# Altium schematic sheet PC104_headers_and_storage.SchDoc
size A3; SheetNumber: 2; SheetTotal: 2
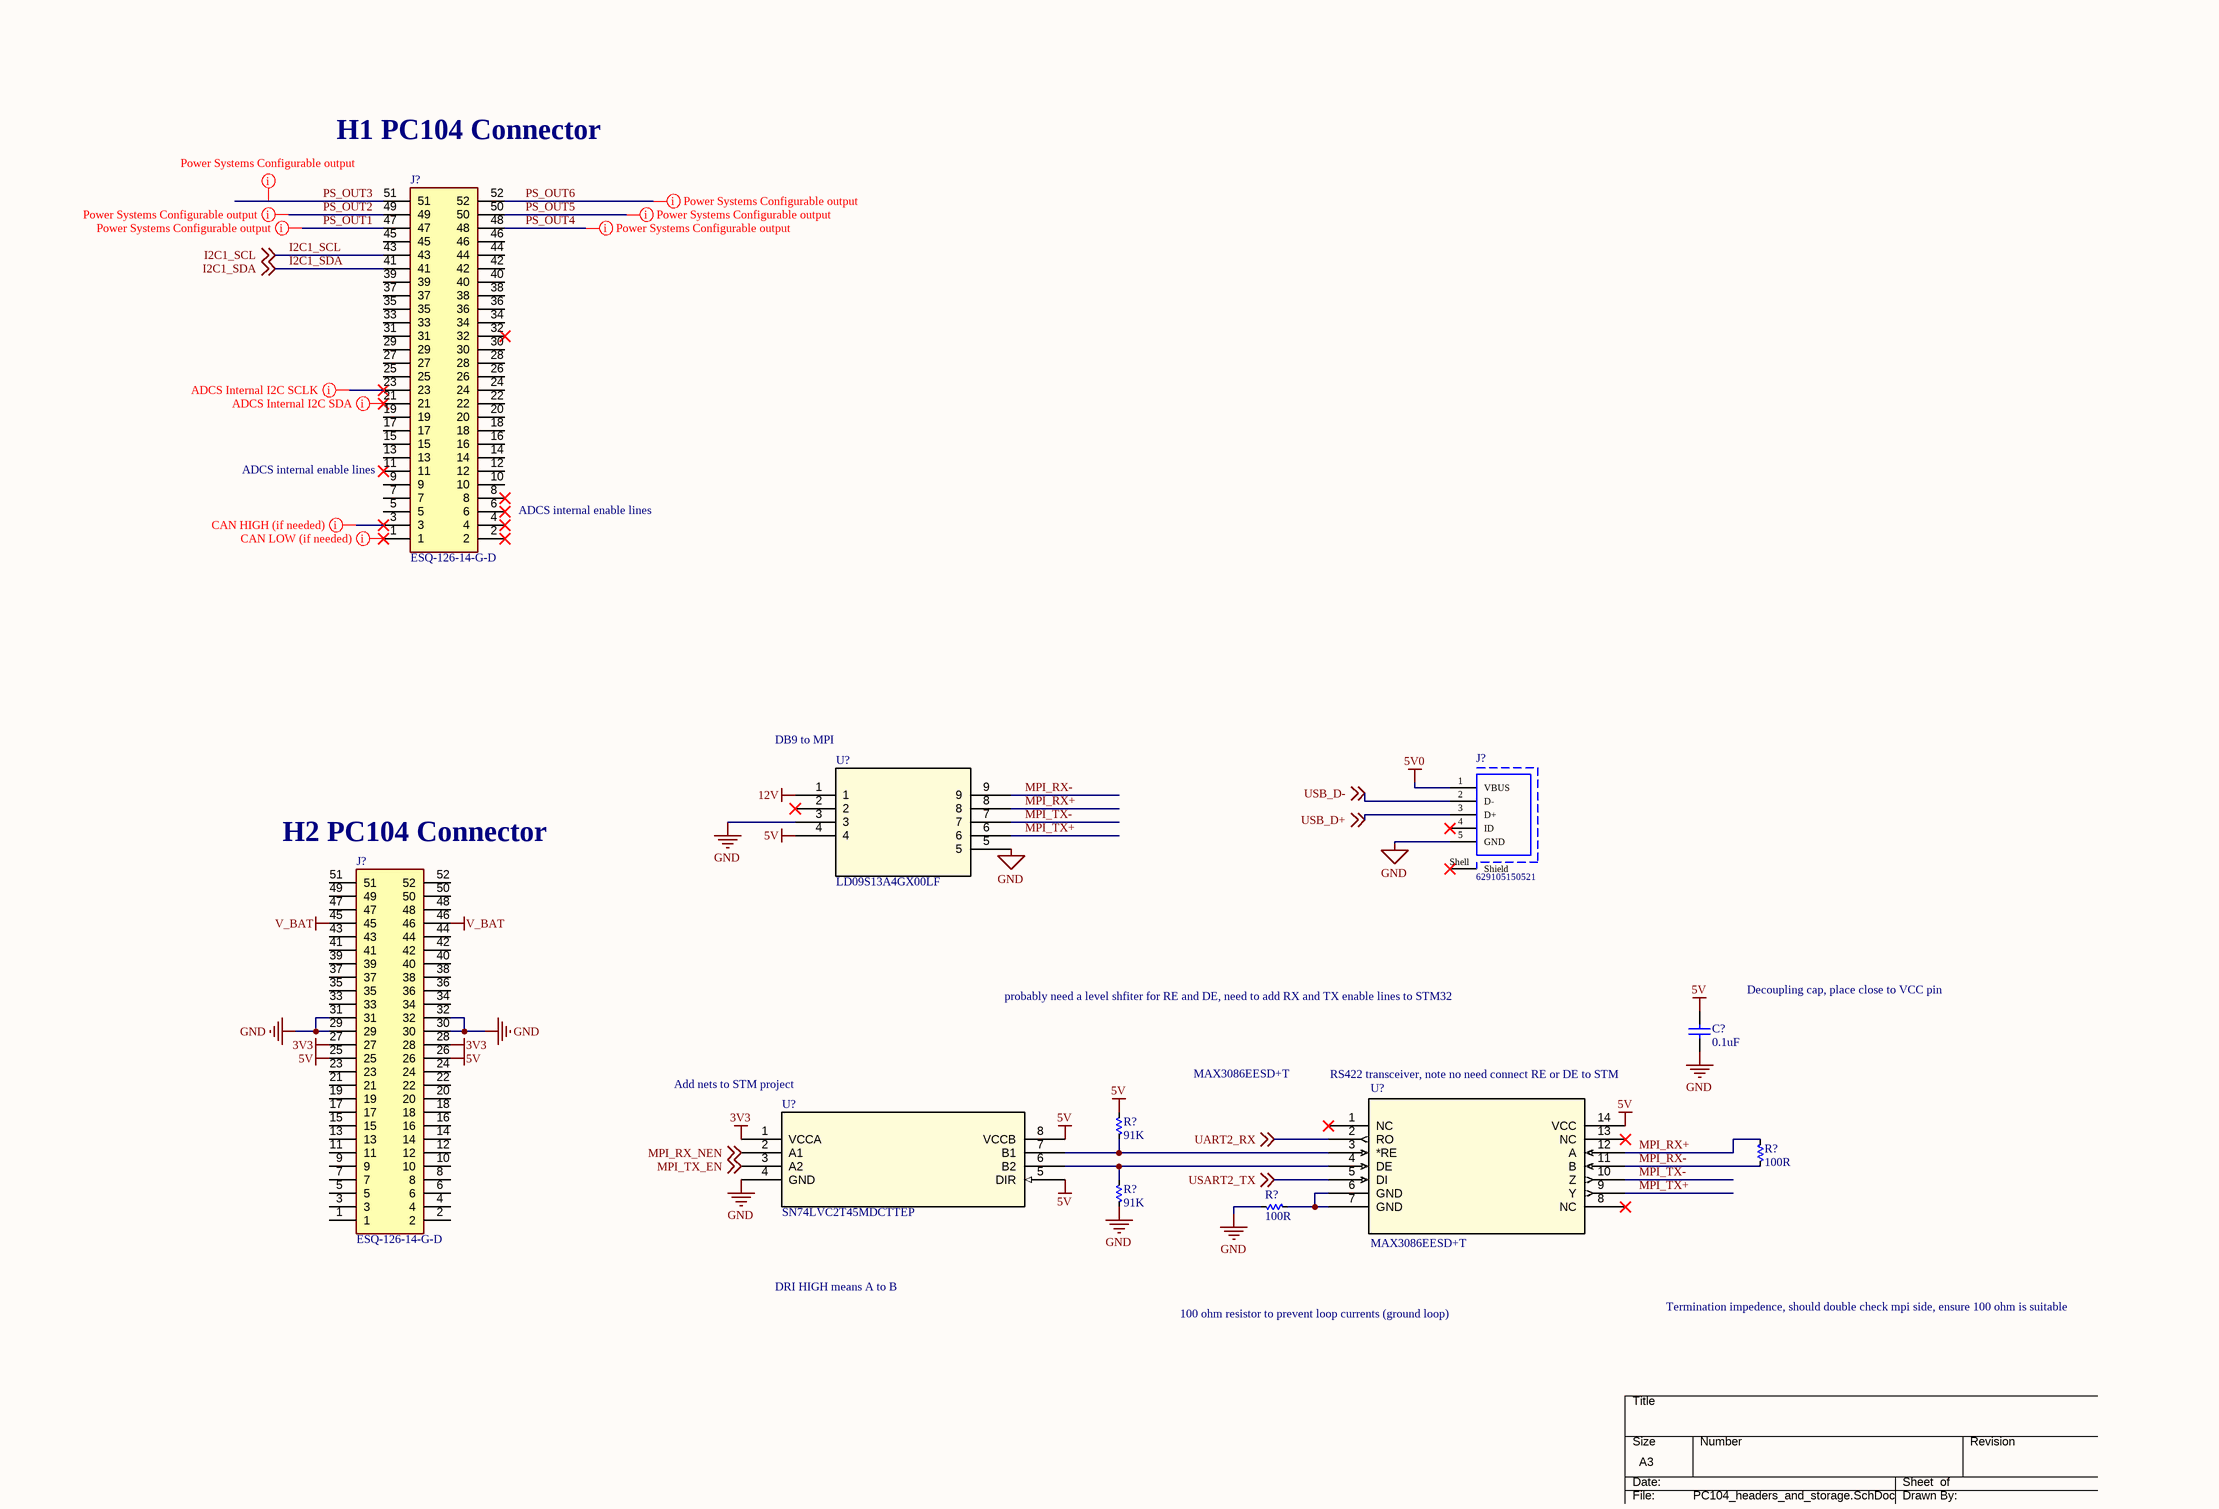
[diagram p0: PC104_headers_and_storage.SchDoc]

## Parts
(Parts that share a designator on the sheet are numbered #1, #2 ... from top to bottom, then left to right.)
C?  0.1uF  [0402]
J?#1  ESQ-126-14-G-D  [ESQ-126-Y-X-D]
J?#2  629105150521  [629105150521]
J?#3  ESQ-126-14-G-D  [ESQ-126-Y-X-D]
R?#1  91K  [0603]
R?#2  100R  [0603]
R?#3  91K  [0603]
R?#4  100R  [0603]
U?#1  LD09S13A4GX00LF  [LD09S13A4GX00LF_AMP]
U?#2  MAX3086EESD+T  [21-0041B_14_MXM]
U?#3  SN74LVC2T45MDCTTEP  [DCT8]

## Nets
3V3: J?#3.27 J?#3.28 U?#3.1(VCCA)
5V: C?.2 J?#3.25 J?#3.26 R?#1.2 U?#1.4 U?#2.14(VCC) U?#3.5(DIR) U?#3.8(VCCB)
5V0: J?#2.1(VBUS)
12V: U?#1.1
GND: C?.1 J?#2.5(GND) J?#3.29 J?#3.30 J?#3.31 J?#3.32 R?#3.1 R?#4.1 U?#1.3 U?#1.5 U?#3.4(GND)
V_BAT: J?#3.45 J?#3.46
I2C1_SCL: J?#1.43 ; off-sheet I2C1_SCL
I2C1_SDA: J?#1.41 ; off-sheet I2C1_SDA
MPI_RX+: R?#2.2 U?#1.8 U?#2.12(A)
MPI_RX-: R?#2.1 U?#1.9 U?#2.11(B)
MPI_RX_NEN: U?#3.2(A1) ; off-sheet MPI_RX_NEN
MPI_TX+: U?#1.6 U?#2.9(Y)
MPI_TX-: U?#1.7 U?#2.10(Z)
MPI_TX_EN: U?#3.3(A2) ; off-sheet MPI_TX_EN
PS_OUT1: J?#1.47
PS_OUT2: J?#1.49
PS_OUT3: J?#1.51
PS_OUT4: J?#1.48
PS_OUT5: J?#1.50
PS_OUT6: J?#1.52
UART2_RX: U?#2.2(RO) ; off-sheet UART2_RX
USART2_TX: U?#2.5(DI) ; off-sheet USART2_TX
USB_D+: J?#2.3(D+) ; off-sheet USB_D+
USB_D-: J?#2.2(D-) ; off-sheet USB_D-
NetR?#1_1: R?#1.1 U?#2.3(*RE) U?#3.7(B1)
NetR?#3_2: R?#3.2 U?#2.4(DE) U?#3.6(B2)
NetR?#4_2: R?#4.2 U?#2.6(GND) U?#2.7(GND)

Not connected (* = marked no-connect by the designer): J?#1 1* 2* 3* 4* 5 6* 7 8* 9 10 11* 12 13 14 15 16 17 18 19 20 21* 22 23* 24 25 26 27 28 29 30 31 32* 33 34 35 36 37 38 39 40 42 44 45 46; J?#2 4(ID)* Shell(Shield)*; J?#3 1 2 3 4 5 6 7 8 9 10 11 12 13 14 15 16 17 18 19 20 21 22 23 24 33 34 35 36 37 38 39 40 41 42 43 44 47 48 49 50 51 52; U?#1 2*; U?#2 1(NC)* 8(NC)* 13(NC)*

## Layout directives
mark named Power Systems Configurable output: PS_OUT1, PS_OUT2, PS_OUT3, PS_OUT4, PS_OUT5, PS_OUT6
mark named CAN LOW (if needed): NetJ?#1_1
mark named CAN HIGH (if needed): NetJ?#1_3
mark named ADCS Internal I2C SDA: NetJ?#1_21
mark named ADCS Internal I2C SCLK: NetJ?#1_23

## Notes on the sheet
- H1 PC104 Connector
- (near J?#1) ADCS internal enable lines
- (near U?#1) DB9 to MPI
- (near J?#3) H2 PC104 Connector
- Decoupling cap, place close to VCC pin
- probably need a level shfiter for RE and DE, need to add RX and TX enable lines to STM32
- (near U?#3) Add nets to STM project
- MAX3086EESD+T
- RS422 transceiver, note no need connect RE or DE to STM
- DRI HIGH means A to B
- 100 ohm resistor to prevent loop currents (ground loop)
- Termination impedence, should double check mpi side, ensure 100 ohm is suitable
- DWG NO:
- REV:
- THIS DOCUMENT AND THE DATA DISCLOSED HEREIN OR
- HEREWITH IS THE PROPERTY OF ALTIUM LIMITED AND MAY
- BE FREELY DISTRIBUTED IN WHOLE. NO RIGHTS ARE
- RESERVED OR EXPRESS OR IMPLIED WARANTEE GIVEN.
- REVISION
- DESCRIPTION
- DATE
- APPROVED
- ENG:
- APPROVALS
- PROJECT
- DSN:
- CHK:
- REFERENCE DOCUMENTS
- PROJECT REVISION:
- TITLE
- DOCUMENT REVISION:
- DESIGN ITEM:
- BOM:
- FAB DWG:
- PCB DWG:
- ASSY DWG:
- SCALE:
- A2
- SIZE
- CAGE CODE
- FILE NAME
- DWG NO.
- SHEET
- OF
- REV

## Library data of the parts
C? = CC-104-K-25V-X5R-0402: CAP CER 0.1UF 25V X5R 0402; Manufacturer: Taiyo Yuden; Manufacturer Part #: TMK105BJ104KV-F; Checked By: *; ComponentLink1description: Datasheet; ComponentLink1URL: https://ds.yuden.co.jp/TYCOMPAS/ut/detail?pn=TMK105BJ104KV-F%20%20&u=M; ComponentLink2description: Manufacturer Website; Created By: *; Distributor: Digikey; Distributor Part #: 587-1456-1-ND; History: *; Notes: *; Part Description: CAP CER 0.1UF 25V X5R 0402; Population: *; ROHS: Yes; SignalCraft Part #: CC-104-K-25V-X5R-0402; ComponentLink2URL: https://www.yuden.co.jp/or/; Value: 0.1uF
J?#1 J?#3 = ESQ-126-14-G-D: Connector; Manufacturer_Name: SAMTEC; Datasheet Link: http://suddendocs.samtec.com/prints/esq-1xx-xx-x-x-xxx-xx-x-xx-mkt.pdf; Manufacturer_Part_Number: ESQ-126-14-G-D; Mouser Part Number: 200-ESQ12614GD; Mouser Price/Stock: https://www.mouser.com/Search/Refine.aspx?Keyword=200-ESQ12614GD; Arrow Part Number: ESQ-126-14-G-D; Arrow Price/Stock: https://www.arrow.com/en/products/esq-126-14-g-d/samtec?region=nac
J?#2 = CMP-1502-03252-1: Micro USB 2.0 Type B Receptacle WR-COM, Horizontal, SMT, with Pegs, High Current at Pin 1 & Pin 5; Manufacturer: Wurth Elektronik; Contact Resistance: 30mOhm; Rated Current: 3A; Working Voltage: 30VAC; Package Reference: 629105150521; Mounting Technology: SMT; Connector Type: MicroUSB2.0TypeB; Operating Temperature: -40to85degC; Orientation: Horizontal; Manufacturer URL: http://www.we-online.de; Datasheet URL: https://katalog.we-online.de/em/datasheet/629105150521.pdf; Part Number: 629105150521; Packaging: TapeandReel; Gender: Receptacle; Publisher: WurthElektronik
R?#1 R?#3 = RT-91k0-F-1/10W-0603: RES SMD 91K OHM 1% 1/10W 0603; Manufacturer: Yageo; Manufacturer Part #: RC0603FR-0791KL; Checked By: *; Created By: *; Distributor: Digikey; Distributor Part #: 311-91.0KHRCT-ND; History: *; Notes: *; Part Description: RES SMD 91K OHM 1% 1/10W 0603; Population: *; ROHS: *; SignalCraft Part #: *; Alternate Distributor Part #: *; Alternate Manufacturer: *; Alternate Manufacturer Part #: *; Value: 91K
R?#2 R?#4 = RT-100R-F-1/10W-0603: 100 Ohms ±1% 0.1W, 1/10W Chip Resistor 0603 (1608 Metric) Automotive AEC-Q200, Moisture Resistant Thick Film; Manufacturer: Yageo; Manufacturer Part #: AC0603FR-13100RL; Part Description: RES 100 OHM 1% 1/10W 0603; Checked By: *; ComponentLink1Description: Datasheet; ComponentLink1URL: https://www.yageo.com/upload/media/product/productsearch/datasheet/rchip/PYu-RC_Group_51_RoHS_L_11.pdf; ComponentLink2Description: Manufacture Website; ComponentLink2URL: https://www.yageo.com/en/Home; Created By: *; Distributor: Digikey; Distributor Part #: 13-AC0603FR-13100RLCT-ND; History: *; Notes: *; Population: *; ROHS: *; SignalCraft Part #: *; Alternate Distributor Part #: *; Alternate Manufacturer: *; Alternate Manufacturer Part #: *; Value: 100R
U?#1 = LD09S13A4GX00LF: No Description Available; Built_By: EMA_Colton; Vendor: Amphenol; SourceLibrary: Add_to_database_2021-03-09; Datasheet: https://www.amphenol-icc.com/media/wysiwyg/files/drawing/10130913.pdf; Copyright: Copyright (C) 2018 Accelerated Designs. All rights reserved; Manufacturer_Part_Number: LD09S13A4GX00LF; RefDes: RefDes; Type: DEV
U?#2 = MAX3086EESD+T: No Description Available; Vendor: Maxim Integrated Products; Built_By: EMA_UL_Team; SourceLibrary: Maxim_2014-06-20; Manufacturer_Part_Number: max3086eesd+T; Copyright: Copyright (C) 2021 Accelerated Designs. All rights reserved; RefDes: RefDes; Type: DEV
U?#3 = SN74LVC2T45MDCTTEP: No Description Available; Manufactuer: Texas Instruments; Copyright: Copyright (C) 2021 Ultra Librarian. All rights reserved.; Manufacturer Part Number: SN74LVC2T45MDCTTEP; Distributor Part Number: 296-23952-1-ND; RefDes: RefDes; Type: DEV